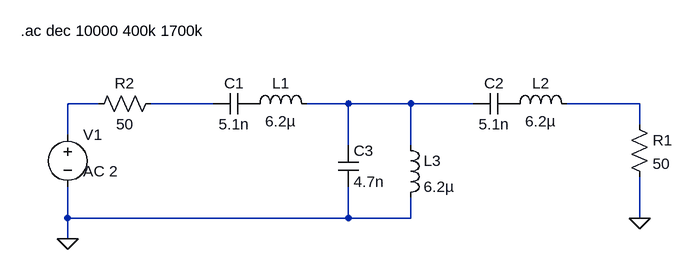
[diagram p0: schematic BandPass.asc]
BandPass.asc, the LTspice schematic file:
Version 4
SHEET 1 888 680
WIRE 0 -1152 -48 -1152
WIRE 176 -1152 80 -1152
WIRE 384 -1152 320 -1152
WIRE 480 -1152 384 -1152
WIRE 576 -1152 480 -1152
WIRE 832 -1152 720 -1152
WIRE 832 -1120 832 -1152
WIRE -48 -1104 -48 -1152
WIRE 384 -1088 384 -1152
WIRE 480 -1088 480 -1152
WIRE -48 -976 -48 -1024
WIRE 384 -976 384 -1024
WIRE 384 -976 -48 -976
WIRE 480 -976 480 -1008
WIRE 480 -976 384 -976
WIRE 832 -976 832 -1040
WIRE -48 -944 -48 -976
FLAG -48 -944 0
FLAG 832 -976 0
SYMBOL voltage -48 -1120 R0
WINDOW 3 24 44 Left 2
WINDOW 123 24 72 Left 2
WINDOW 39 0 0 Left 0
SYMATTR Value ""
SYMATTR Value2 AC 2
SYMATTR InstName V1
SYMBOL res 816 -1136 R0
SYMATTR InstName R1
SYMATTR Value 50
SYMBOL res 96 -1168 R90
WINDOW 0 0 56 VBottom 2
WINDOW 3 32 56 VTop 2
SYMATTR InstName R2
SYMATTR Value 50
SYMBOL cap 240 -1168 R90
WINDOW 0 0 32 VBottom 2
WINDOW 3 32 32 VTop 2
SYMATTR InstName C1
SYMATTR Value 5.1n
SYMBOL ind 224 -1136 R270
WINDOW 0 32 56 VTop 2
WINDOW 3 5 56 VBottom 2
SYMATTR InstName L1
SYMATTR Value 6.2µ
SYMBOL ind 624 -1136 R270
WINDOW 0 32 56 VTop 2
WINDOW 3 5 56 VBottom 2
SYMATTR InstName L2
SYMATTR Value 6.2µ
SYMBOL cap 640 -1168 R90
WINDOW 0 0 32 VBottom 2
WINDOW 3 32 32 VTop 2
SYMATTR InstName C2
SYMATTR Value 5.1n
SYMBOL cap 368 -1088 R0
SYMATTR InstName C3
SYMATTR Value 4.7n
SYMBOL ind 464 -1104 R0
SYMATTR InstName L3
SYMATTR Value 6.2µ
TEXT -120 -1264 Left 2 !.ac dec 10000 400k 1700k

The netlist it stands for:
* BandPass.asc
V1 N001 0 AC 2
R1 N004 0 50
R2 N002 N001 50
C1 P001 N002 5.1n
L1 P001 N003 6.2µ
L2 P002 N004 6.2µ
C2 P002 N003 5.1n
C3 N003 0 4.7n
L3 N003 0 6.2µ
.ac dec 10000 400k 1700k
.backanno
.end